# EAGLE design flowShield (EAGLE 6.3)
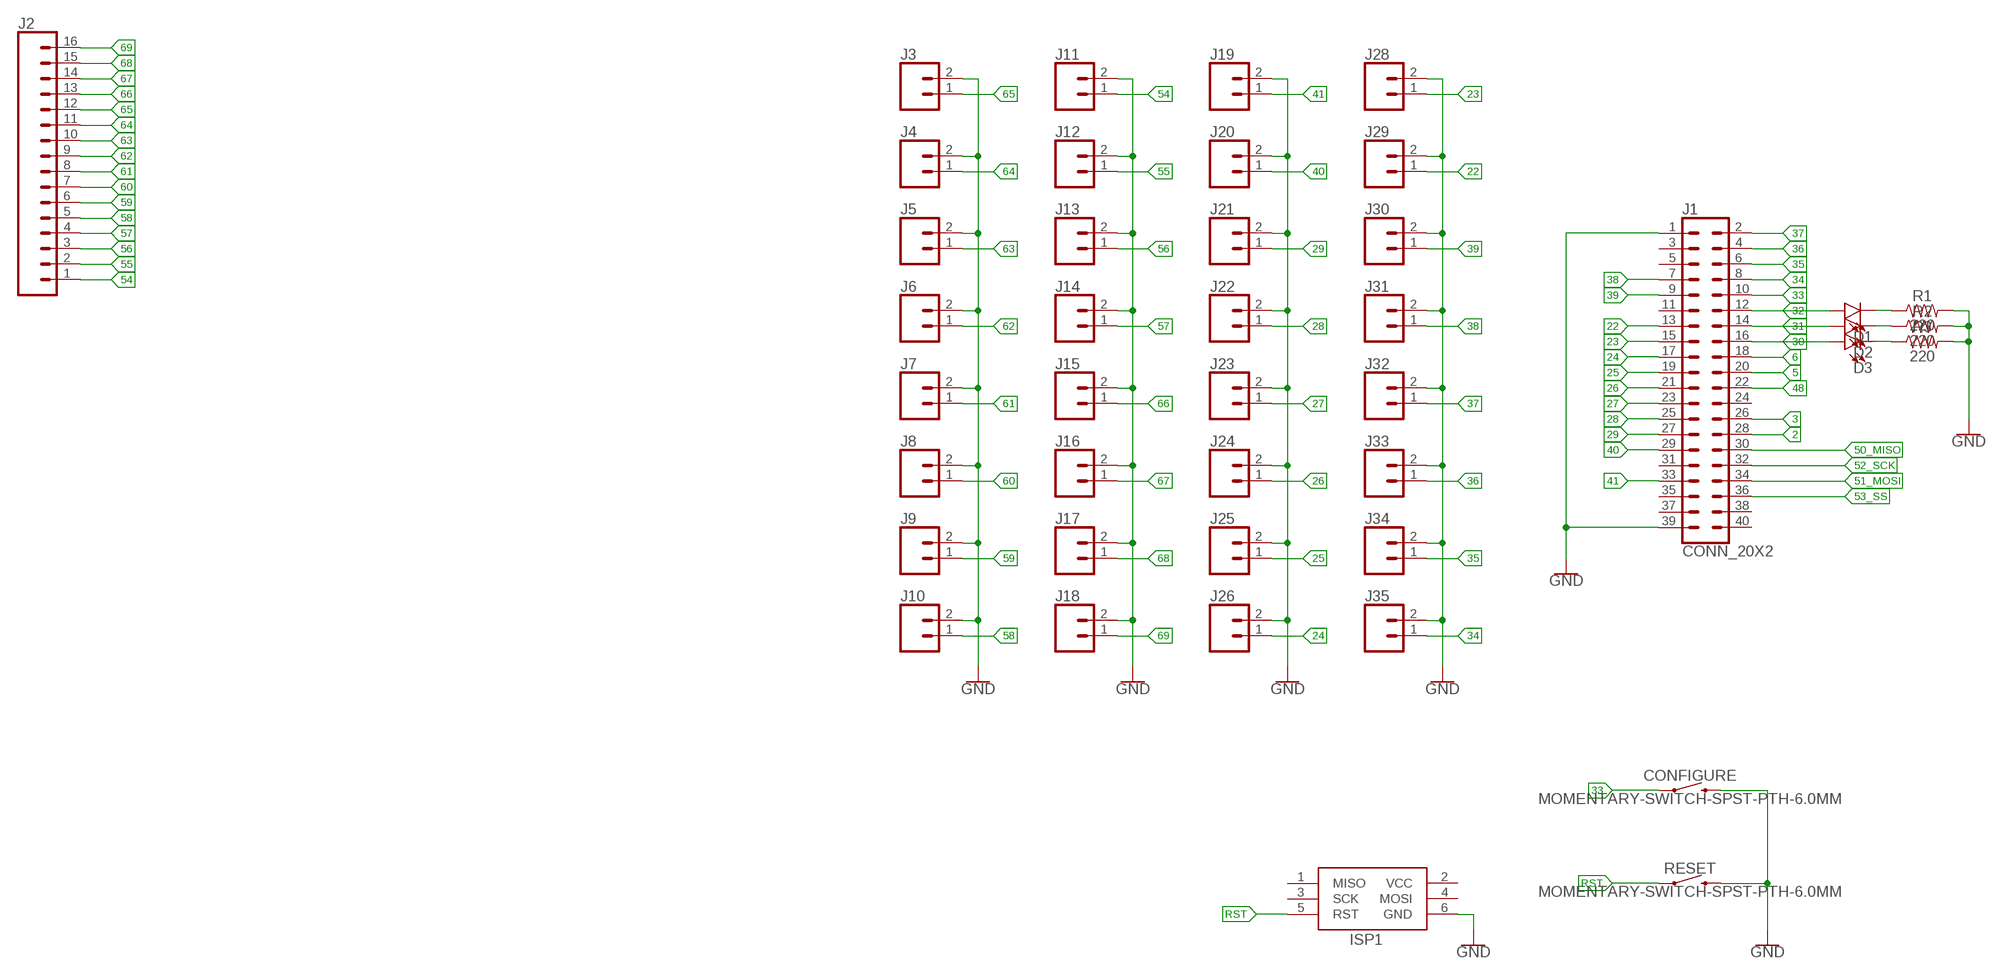
[diagram p0: schematic, sheet 1]

## Parts
CONFIGURE  MOMENTARY-SWITCH-SPST-PTH-6.0MM  [TACTILE_SWITCH_PTH_6.0MM]
D1  LED3MM  [LED_3MM]
D2  LED3MM  [LED_3MM]
D3  LED3MM  [LED_3MM]
ISP1  ADAFRUIT_AVRISP-6  [ADAFRUIT_AVRISP]
J1  CONN_20X2  [2X20]
J2  CONN_16  [1X16]
J3  CONN_025MM  [SCREWTERMINAL-5MM-2]
J4  CONN_025MM  [SCREWTERMINAL-5MM-2]
J5  CONN_025MM  [SCREWTERMINAL-5MM-2]
J6  CONN_025MM  [SCREWTERMINAL-5MM-2]
J7  CONN_025MM  [SCREWTERMINAL-5MM-2]
J8  CONN_025MM  [SCREWTERMINAL-5MM-2]
J9  CONN_025MM  [SCREWTERMINAL-5MM-2]
J10  CONN_025MM  [SCREWTERMINAL-5MM-2]
J11  CONN_025MM  [SCREWTERMINAL-5MM-2]
J12  CONN_025MM  [SCREWTERMINAL-5MM-2]
J13  CONN_025MM  [SCREWTERMINAL-5MM-2]
J14  CONN_025MM  [SCREWTERMINAL-5MM-2]
J15  CONN_025MM  [SCREWTERMINAL-5MM-2]
J16  CONN_025MM  [SCREWTERMINAL-5MM-2]
J17  CONN_025MM  [SCREWTERMINAL-5MM-2]
J18  CONN_025MM  [SCREWTERMINAL-5MM-2]
J19  CONN_025MM  [SCREWTERMINAL-5MM-2]
J20  CONN_025MM  [SCREWTERMINAL-5MM-2]
J21  CONN_025MM  [SCREWTERMINAL-5MM-2]
J22  CONN_025MM  [SCREWTERMINAL-5MM-2]
J23  CONN_025MM  [SCREWTERMINAL-5MM-2]
J24  CONN_025MM  [SCREWTERMINAL-5MM-2]
J25  CONN_025MM  [SCREWTERMINAL-5MM-2]
J26  CONN_025MM  [SCREWTERMINAL-5MM-2]
J28  CONN_025MM  [SCREWTERMINAL-5MM-2]
J29  CONN_025MM  [SCREWTERMINAL-5MM-2]
J30  CONN_025MM  [SCREWTERMINAL-5MM-2]
J31  CONN_025MM  [SCREWTERMINAL-5MM-2]
J32  CONN_025MM  [SCREWTERMINAL-5MM-2]
J33  CONN_025MM  [SCREWTERMINAL-5MM-2]
J34  CONN_025MM  [SCREWTERMINAL-5MM-2]
J35  CONN_025MM  [SCREWTERMINAL-5MM-2]
R1  220  1KOHM-HORIZ-1/4W-1%  [AXIAL-0.3]
R2  220  1KOHM-HORIZ-1/4W-1%  [AXIAL-0.3]
R3  220  1KOHM-HORIZ-1/4W-1%  [AXIAL-0.3]
RESET  MOMENTARY-SWITCH-SPST-PTH-6.0MM  [TACTILE_SWITCH_PTH_6.0MM]

## Nets
2: J1.28
3: J1.26
5: J1.20
6: J1.18
22: J1.13 J29.1
23: J1.15 J28.1
24: J1.17 J26.1
25: J1.19 J25.1
26: J1.21 J24.1
27: J1.23 J23.1
28: J1.25 J22.1
29: J1.27 J21.1
30: D3.A J1.16
31: D2.A J1.14
32: D1.A J1.12
33: CONFIGURE.1 J1.10
34: J1.8 J35.1
35: J1.6 J34.1
36: J1.4 J33.1
37: J1.2 J32.1
38: J1.7 J31.1
39: J1.9 J30.1
40: J1.29 J20.1
41: J1.33 J19.1
48: J1.22
50_MISO: J1.30
51_MOSI: J1.34
52_SCK: J1.32
53_SS: J1.36
54: J2.1 J11.1
55: J2.2 J12.1
56: J2.3 J13.1
57: J2.4 J14.1
58: J2.5 J10.1
59: J2.6 J9.1
60: J2.7 J8.1
61: J2.8 J7.1
62: J2.9 J6.1
63: J2.10 J5.1
64: J2.11 J4.1
65: J2.12 J3.1
66: J2.13 J15.1
67: J2.14 J16.1
68: J2.15 J17.1
69: J2.16 J18.1
GND: CONFIGURE.3 ISP1.6(GND) J1.1 J1.39 J3.2 J4.2 J5.2 J6.2 J7.2 J8.2 J9.2 J10.2 J11.2 J12.2 J13.2 J14.2 J15.2 J16.2 J17.2 J18.2 J19.2 J20.2 J21.2 J22.2 J23.2 J24.2 J25.2 J26.2 J28.2 J29.2 J30.2 J31.2 J32.2 J33.2 J34.2 J35.2 R1.P$2 R2.P$2 R3.P$2 RESET.3
N$1: D1.K(C) R1.P$1
N$2: D2.K(C) R2.P$1
N$3: D3.K(C) R3.P$1
RST: ISP1.5(RST) RESET.1
Unconnected: ISP1.1(MISO) ISP1.3(SCK) ISP1.4(MOSI) J1.3 J1.5 J1.11 J1.24 J1.31 J1.35 J1.37 J1.38 J1.40

## Power pins joined to a net without a drawn wire
VCC: ISP1.2(VCC)

## Library data of the parts
CONFIGURE RESET = SparkFun-Switches:MOMENTARY-SWITCH-SPST: Momentary Switch (Pushbutton) - SPST Normally-open (NO) SPST momentary switches (buttons, pushbuttons). Variants PTH-12MM - 12mm square, through-hole Momentary Pushbutton Switch - 12mm Square <https://www.sparkfun.com/products/9190> (COM-09190) PTH-6.0MM, PTH-6.0MM-KIT - 6.0mm square, through-hole Mini Pushbutton Switch <https://www.sparkfun.com/products/97> (COM-00097) KIT package intended for soldering kit's - only one side of pads' copper is exposed. PTH-RIGHT-ANGLE-KIT - Right-angle, through-hole Right Angle Tactile Button <https://www.sparkfun.com/products/10791> - Used on SparkFun BigTime Watch Kit <https://www.sparkfun.com/products/11734> SMD-12MM - 12mm square, surface-mount Tactile Button - SMD (12mm) <https://www.sparkfun.com/products/12993> (COM-12993) Used on SparkFun PicoBoard <https://www.sparkfun.com/products/11888> SMD-4.5MM - 4.5mm Square Trackball Switch Used on SparkFun Blackberry Trackballer Breakout <https://www.sparkfun.com/products/13169> SMD-4.6MMX2.8MM - 4.60mm x 2.80mm, surface mount Used on SparkFun SAMD21 Mini Breakout <https://www.sparkfun.com/products/13664> SMD-5.2MM, SMD-5.2-REDUNDANT - 5.2mm square, surface-mount Mini Pushbutton Switch - SMD <https://www.sparkfun.com/products/8720> (COM-08720) Used on Arduino Pro Mini <https://www.sparkfun.com/products/11114> REDUNDANT package connects both switch circuits together SMD-6.0X3.5MM - 6.0 x 3.5mm, surface mount Momentary Reset Switch SMD <https://www.sparkfun.com/products/8229> (COM-08229) SMD-6.2MM-TALL - 6.2mm square, surface mount Tactile Button - SMD (6mm) <https://www.sparkfun.com/products/12992> Used on SparkFun Digital Sandbox <https://www.sparkfun.com/products/12651> SMD-RIGHT-ANGLE - Right-angle, surface mount Used on SparkFun Block for Intel® Edison - Arduino <https://www.sparkfun.com/products/13036>; PROD_ID: SWCH-08441; SF_SKU: COM-00097
D1-D3 = SparkFun-LED:LED: LED (Generic) Standard schematic elements and footprints for 5mm, 3mm, 1206, and 0603 sized LEDs. Generic LEDs with no color specified.; PROD_ID: DIO-08794
ISP1 = tempLED_GARAGE_BOX:ADAFRUIT_AVRISP: AVR ISP HEADER Standard 6 pin header for AVR programming
J1 = SparkFun-Connectors:CONN_20X2: Multi connection point. Often used as Generic Header-pin footprint for 0.1 inch spaced/style header connections On any of the 0.1 inch spaced packages, you can populate with these: Break Away Headers - Straight <https://www.sparkfun.com/products/116> (PRT-00116) Break Away Male Headers - Right Angle <https://www.sparkfun.com/products/553> (PRT-00553) Female Headers <https://www.sparkfun.com/products/115> (PRT-00115) Break Away Headers - Machine Pin <https://www.sparkfun.com/products/117> (PRT-00117) Break Away Female Headers - Swiss Machine Pin <https://www.sparkfun.com/products/743> (PRT-00743)
J2 = SparkFun-Connectors:CONN_16: Multi connection point. Often used as Generic Header-pin footprint for 0.1 inch spaced/style header connections On any of the 0.1 inch spaced packages, you can populate with these: Break Away Headers - Straight <https://www.sparkfun.com/products/116> (PRT-00116) Break Away Male Headers - Right Angle <https://www.sparkfun.com/products/553> (PRT-00553) Female Headers <https://www.sparkfun.com/products/115> (PRT-00115) Break Away Headers - Machine Pin <https://www.sparkfun.com/products/117> (PRT-00117) Break Away Female Headers - Swiss Machine Pin <https://www.sparkfun.com/products/743> (PRT-00743) For SCREWTERMINALS and SPRING TERMINALS visit here: Screw Terimnals on SparkFun.com <https://www.sparkfun.com/search/results?term=Screw+Terminals> (5mm/3.5mm/2.54mm spacing) This device is also useful as a general connection point to wire up your design to another part of your project. Our various solder wires solder well into these plated through hole pads. Hook-Up Wire - Assortment (Stranded, 22 AWG) <https://www.sparkfun.com/products/11375> (PRT-11375) Hook-Up Wire - Assortment (Solid Core, 22 AWG) <https://www.sparkfun.com/products/11367> (PRT-11367) View the entire wire category on our website here <https://www.sparkfun.com/categories/141> Special notes: Molex polarized connector foot print use with SKU : PRT-08231 with associated crimp pins and housings. 1MM SMD Version SKU: PRT-10208 NOTES ON THE VARIANTS LOCK and LOCK_LONGPADS... This footprint was designed to help hold the alignment of a through-hole component (i.e. 6-pin header) while soldering it into place. You may notice that each hole has been shifted either up or down by 0.005 of an inch from it's more standard position (which is a perfectly straight line). This slight alteration caused the pins (the squares in the middle) to touch the edges of the holes. Because they are alternating, it causes a "brace" to hold the component in place. 0.005 has proven to be the perfect amount of "off-center" position when using our standard breakaway headers. Although looks a little odd when you look at the bare footprint, once you have a header in there, the alteration is very hard to notice. Also,if you push a header all the way into place, it is covered up entirely on the bottom side.
J3-J26 J28-J35 = SparkFun-Connectors:CONN_02: Multi connection point. Often used as Generic Header-pin footprint for 0.1 inch spaced/style header connections On any of the 0.1 inch spaced packages, you can populate with these: Break Away Headers - Straight <https://www.sparkfun.com/products/116> (PRT-00116) Break Away Male Headers - Right Angle <https://www.sparkfun.com/products/553> (PRT-00553) Female Headers <https://www.sparkfun.com/products/115> (PRT-00115) Break Away Headers - Machine Pin <https://www.sparkfun.com/products/117> (PRT-00117) Break Away Female Headers - Swiss Machine Pin <https://www.sparkfun.com/products/743> (PRT-00743) For SCREWTERMINALS and SPRING TERMINALS visit here: Screw Terimnals on SparkFun.com <https://www.sparkfun.com/search/results?term=Screw+Terminals> (5mm/3.5mm/2.54mm spacing) This device is also useful as a general connection point to wire up your design to another part of your project. Our various solder wires solder well into these plated through hole pads. Hook-Up Wire - Assortment (Stranded, 22 AWG) <https://www.sparkfun.com/products/11375> (PRT-11375) Hook-Up Wire - Assortment (Solid Core, 22 AWG) <https://www.sparkfun.com/products/11367> (PRT-11367) View the entire wire category on our website here <https://www.sparkfun.com/categories/141> Special notes: Molex polarized connector foot print use with: PRT-08233 with associated crimp pins and housings. 2.54_SCREWTERM for use with PRT-10571. 3.5mm Screw Terminal footprints for PRT-08084 5mm Screw Terminal footprints for use with PRT-08432; SF_SKU: PRT-08432
R1-R3 = SparkFun-Resistors:1KOHM: 1kΩ resistor A resistor is a passive two-terminal electrical component that implements electrical resistance as a circuit element. Resistors act to reduce current flow, and, at the same time, act to lower voltage levels within circuits. - Wikipedia; PROD_ID: RES-12182; VALUE: 1k

## Board
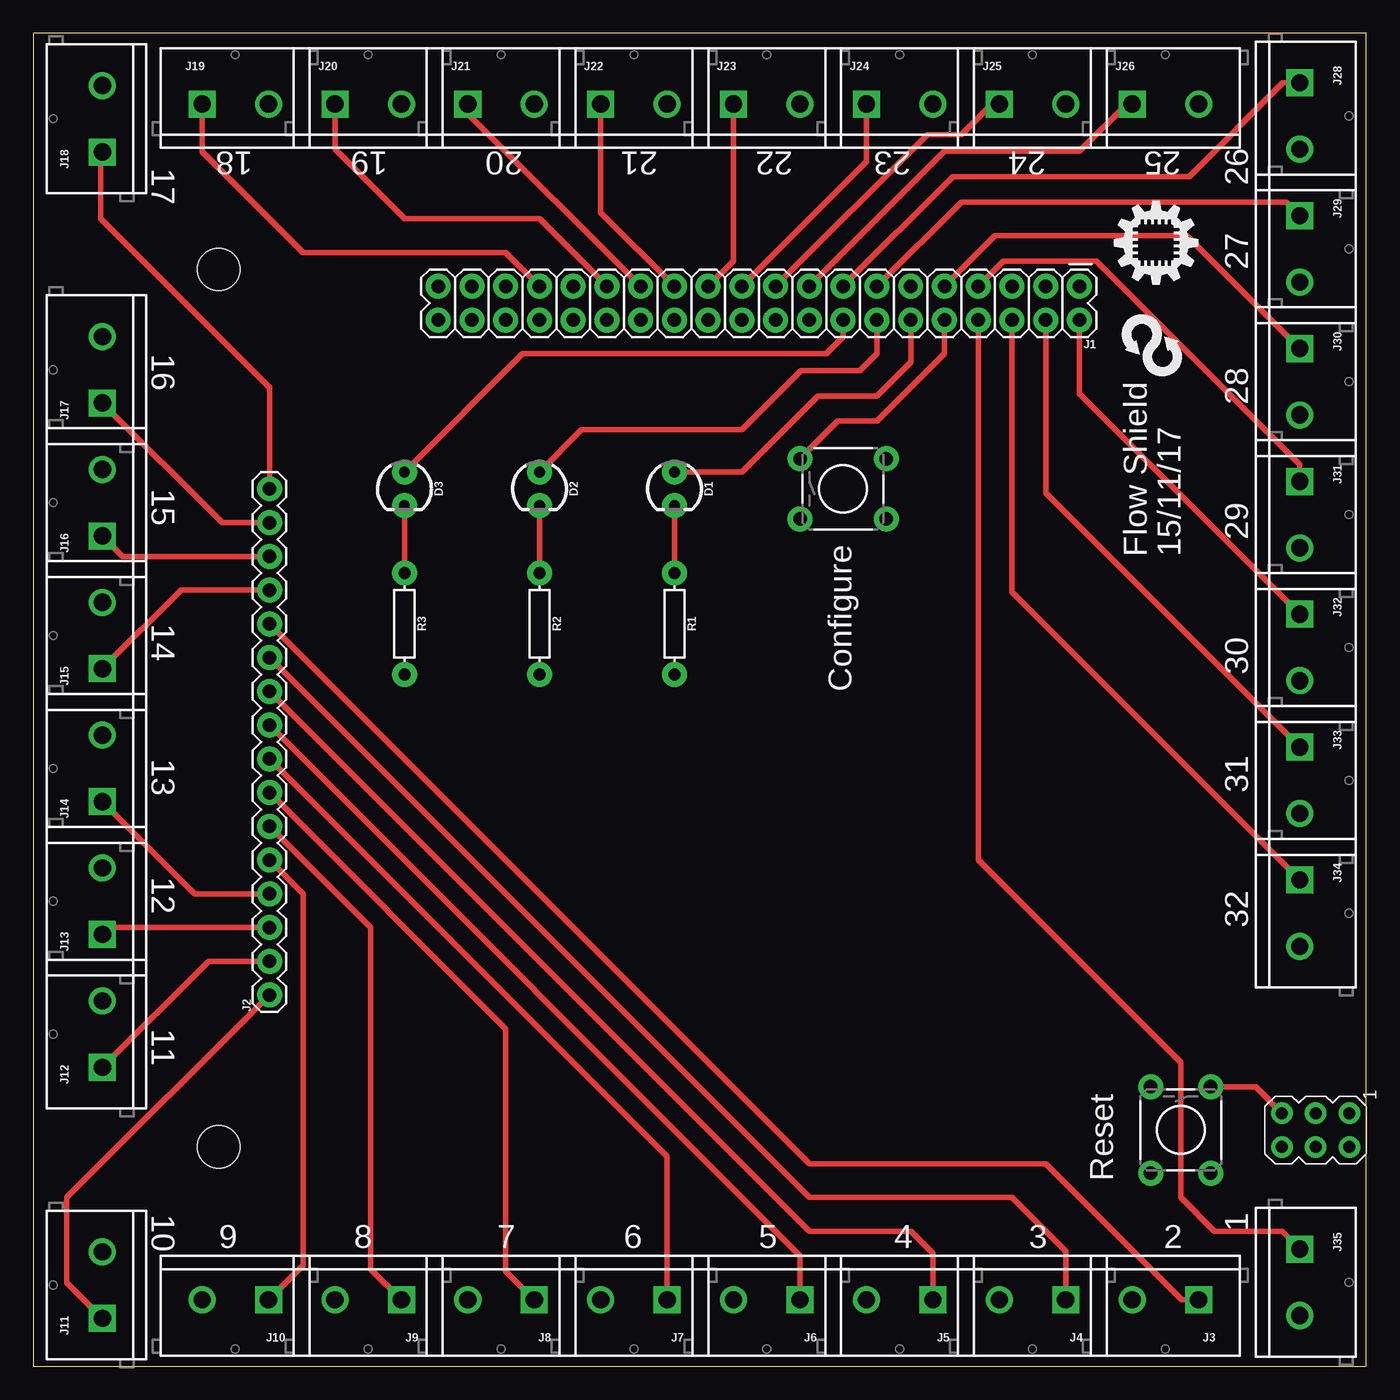
[diagram p1: board, top side]
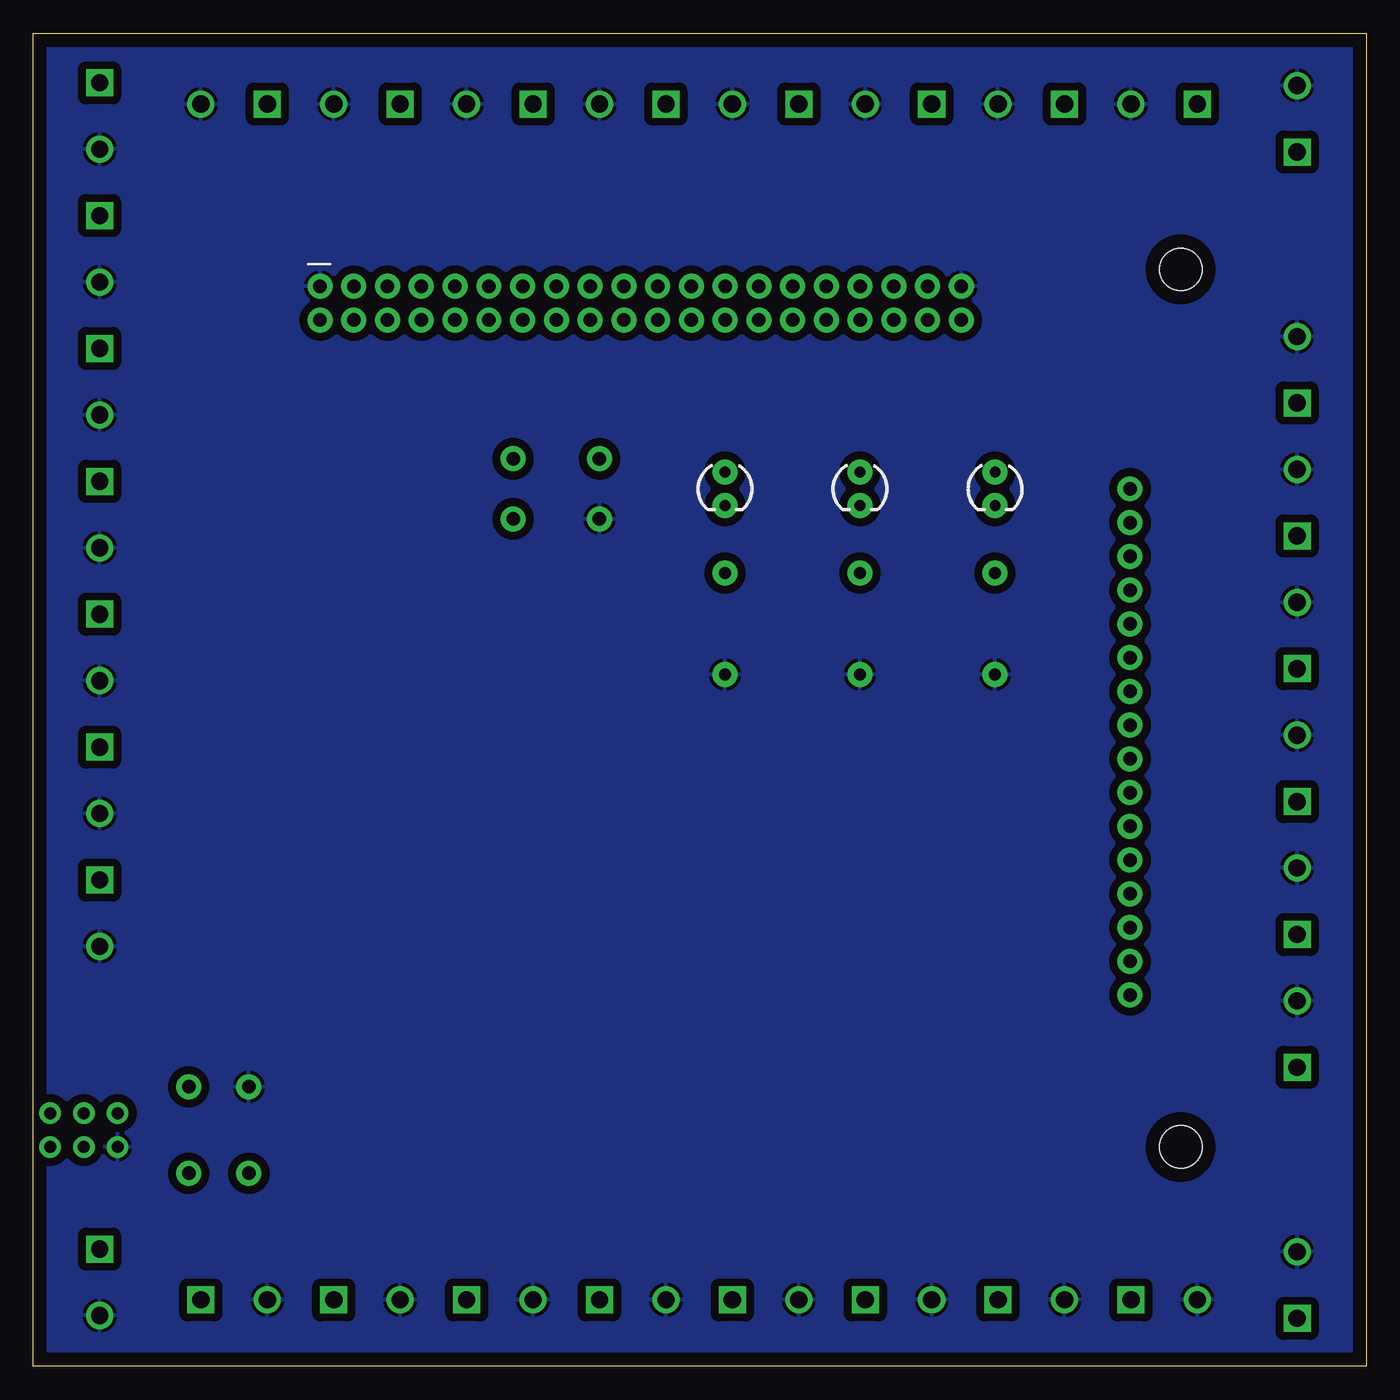
[diagram p2: board, bottom side, seen from below]

Size 100.33 x 100.33 mm. Coordinates in mm from the lower left corner, seen from the top.
Outline: 0,0 100.33,0 100.33,100.33 0,100.33 0,0
Copper layers (1*16): Top 0.035mm / dielectric 1.5mm / Bottom 0.035mm
Design rules "default": minimum track width 10mil, minimum drill 24mil, track to track 8mil, track to pad 8mil, pad to pad 8mil, via to via 8mil, smd to smd 8mil, copper to edge 40mil, drill to drill 8mil, minimum pad ring 10mil, minimum via ring 8mil, stop-mask expansion 4mil, vias tented up to drill 0mil, thermal gap 10mil
Holes 3.2 mm at 13.97,82.55 13.97,16.51

### Footprints (pad centres in the part's own frame; a part is rotated, then mirrored left to right if it is on the bottom)
TACTILE_SWITCH_PTH_6.0MM = drill 1.016 pad 1.88: 1 -3.251,2.261; 2 3.251,2.261; 3 -3.251,-2.261; 4 3.251,-2.261
LED_3MM = drill 0.813 pad 1.88: A -1.27,0; K 1.27,0
ADAFRUIT_AVRISP = drill 0.9 pad 1.626: 1 -1.27,2.54; 2 1.27,2.54; 3 -1.27,0; 4 1.27,0; 5 -1.27,-2.54; 6 1.27,-2.54
2X20 = drill 1.016 pad 1.88: 1 0,0; 2 0,2.54; 3 2.54,0; 4 2.54,2.54; 5 5.08,0; 6 5.08,2.54; 7 7.62,0; 8 7.62,2.54; 9 10.16,0; 10 10.16,2.54; 11 12.7,0; 12 12.7,2.54; 13 15.24,0; 14 15.24,2.54; 15 17.78,0; 16 17.78,2.54; 17 20.32,0; 18 20.32,2.54; 19 22.86,0; 20 22.86,2.54; 21 25.4,0; 22 25.4,2.54; 23 27.94,0; 24 27.94,2.54; 25 30.48,0; 26 30.48,2.54; 27 33.02,0; 28 33.02,2.54; 29 35.56,0; 30 35.56,2.54; 31 38.1,0; 32 38.1,2.54; 33 40.64,0; 34 40.64,2.54; 35 43.18,0; 36 43.18,2.54; 37 45.72,0; 38 45.72,2.54; 39 48.26,0; 40 48.26,2.54
1X16 = drill 1.016 pad 1.88: 1 0,0; 2 2.54,0; 3 5.08,0; 4 7.62,0; 5 10.16,0; 6 12.7,0; 7 15.24,0; 8 17.78,0; 9 20.32,0; 10 22.86,0; 11 25.4,0; 12 27.94,0; 13 30.48,0; 14 33.02,0; 15 35.56,0; 16 38.1,0
SCREWTERMINAL-5MM-2 = drill 1.3 pad 2.032 square: 1 0,0 | drill 1.3 pad 2.032: 2 5,0
AXIAL-0.3 = drill 0.9 pad 1.88: P$1 -3.81,0; P$2 3.81,0

### Placement (x,y rotation side)
CONFIGURE  60.96,66.04 0 top
D1  48.26,66.04 270 top
D2  38.1,66.04 270 top
D3  27.94,66.04 270 top
ISP1  96.52,17.78 270 top
J1  78.74,81.28 180 top
J2  17.78,27.94 90 top
J3  87.71,5 180 top
J4  77.71,5 180 top
J5  67.71,5 180 top
J6  57.71,5 180 top
J7  47.71,5 180 top
J8  37.71,5 180 top
J9  27.71,5 180 top
J10  17.71,5 180 top
J11  5.21,3.61 90 top
J12  5.21,22.5 90 top
J13  5.21,32.5 90 top
J14  5.21,42.5 90 top
J15  5.21,52.5 90 top
J16  5.21,62.5 90 top
J17  5.21,72.5 90 top
J18  5.21,91.39 90 top
J19  12.71,95 0 top
J20  22.71,95 0 top
J21  32.71,95 0 top
J22  42.71,95 0 top
J23  52.71,95 0 top
J24  62.71,95 0 top
J25  72.71,95 0 top
J26  82.71,95 0 top
J28  95.33,96.6 270 top
J29  95.33,86.6 270 top
J30  95.33,76.6 270 top
J31  95.33,66.6 270 top
J32  95.33,56.6 270 top
J33  95.33,46.6 270 top
J34  95.33,36.6 270 top
J35  95.33,8.82 270 top
R1  48.26,55.88 270 top
R2  38.1,55.88 270 top
R3  27.94,55.88 270 top
RESET  86.36,17.78 270 top
U$1  [ID_LOGO_X0.25]  81.28,81.28 0 top
U$12  [REFACTORLOOP]  84.48,77.05 0 top

### Tracks (layer width: path | path; a pad name or v marks a point on that pad's centre or on a via)
22
  Top 0.406: J1.13 69.85,87.63 94.3,87.63 J29.1
23
  Top 0.406: J1.15 69.22,89.53 87,89.53 94.06,96.6 J28.1
24
  Top 0.406: J1.17 68.58,91.44 78.74,91.44 82.3,95 J26.1
25
  Top 0.406: J1.19 67.31,92.71 69.85,92.71 72.14,95 J25.1
26
  Top 0.406: J1.21 62.71,90.65 J24.1
27
  Top 0.406: J1.23 52.71,83.19 J23.1
28
  Top 0.406: J1.25 42.71,86.83 J22.1
29
  Top 0.406: J1.27 32.71,94.29 J21.1
30
  Top 0.406: J1.16 60.96,77.47 59.69,76.2 36.83,76.2 D3.A
31
  Top 0.406: J1.14 63.5,76.2 62.23,74.93 57.78,74.93 53.34,70.48 41.27,70.48 D2.A
32
  Top 0.406: J1.12 66.04,75.56 63.5,73.03 59.05,73.03 53.34,67.31 D1.A
33
  Top 0.406: J1.10 68.58,76.2 63.5,71.12 60.53,71.12 CONFIGURE.1
34
  Top 0.406: J1.8 71.12,38.1 86.36,22.86 86.36,12.7 88.9,10.16 93.99,10.16 J35.1
35
  Top 0.406: J1.6 73.66,58.27 J34.1
36
  Top 0.406: J1.4 76.2,65.73 J33.1
37
  Top 0.406: J1.2 78.74,73.19 J32.1
38
  Top 0.406: J1.7 73.03,83.19 80.01,83.19 95.33,67.86 J31.1
39
  Top 0.406: J30.1 86.84,85.09 72.39,85.09 J1.9
40
  Top 0.406: J1.29 38.1,86.36 27.94,86.36 22.71,91.59 J20.1
41
  Top 0.406: J1.33 35.56,83.82 20.32,83.82 12.71,91.43 J19.1
54
  Top 0.406: J2.1 2.54,12.7 2.54,6.28 J11.1
55
  Top 0.406: J2.2 13.19,30.48 J12.1
56
  Top 0.406: J2.3 5.73,33.02 J13.1
57
  Top 0.406: J2.4 12.15,35.56 J14.1
58
  Top 0.406: J2.5 20.32,35.56 20.32,7.61 J10.1
59
  Top 0.406: J2.6 25.4,33.02 25.4,7.31 J9.1
60
  Top 0.406: J2.7 35.56,25.4 35.56,7.15 J8.1
61
  Top 0.406: J2.8 47.71,15.79 J7.1
62
  Top 0.406: J2.9 57.71,8.33 J6.1
63
  Top 0.406: J2.10 58.42,10.16 66.04,10.16 67.71,8.49 J5.1
64
  Top 0.406: J2.11 58.42,12.7 73.66,12.7 77.71,8.65 J4.1
65
  Top 0.406: J2.12 58.42,15.24 76.2,15.24 86.44,5 J3.1
66
  Top 0.406: J2.13 11.13,58.42 J15.1
67
  Top 0.406: J2.14 6.75,60.96 J16.1
68
  Top 0.406: J2.15 14.21,63.5 J17.1
69
  Top 0.406: J2.16 17.78,73.66 5.08,86.36 5.08,91.26 J18.1
GND
  pour Bottom (isolate 0.61): 0,100.33 100.33,100.33 100.33,0 0,0
N$1
  Top 0.406: D1.K R1.P$1
N$2
  Top 0.406: D2.K R2.P$1
N$3
  Top 0.406: D3.K R3.P$1
RST
  Top 0.406: RESET.1 92,21.03 ISP1.5

### Text on the board
tPlace: 18 | 19 | 20 | 21 | 22 | 23 | 24 | 25 | 17 | 26 | 27 | 16 | 28 | 15 | 29 | Flow Shield | 15/11/17 | 14 | 30 | Configure | 13 | 31 | 12 | 32 | 11 | Reset | 10 | 1 | 9 | 8 | 7 | 6 | 5 | 4 | 3 | 2